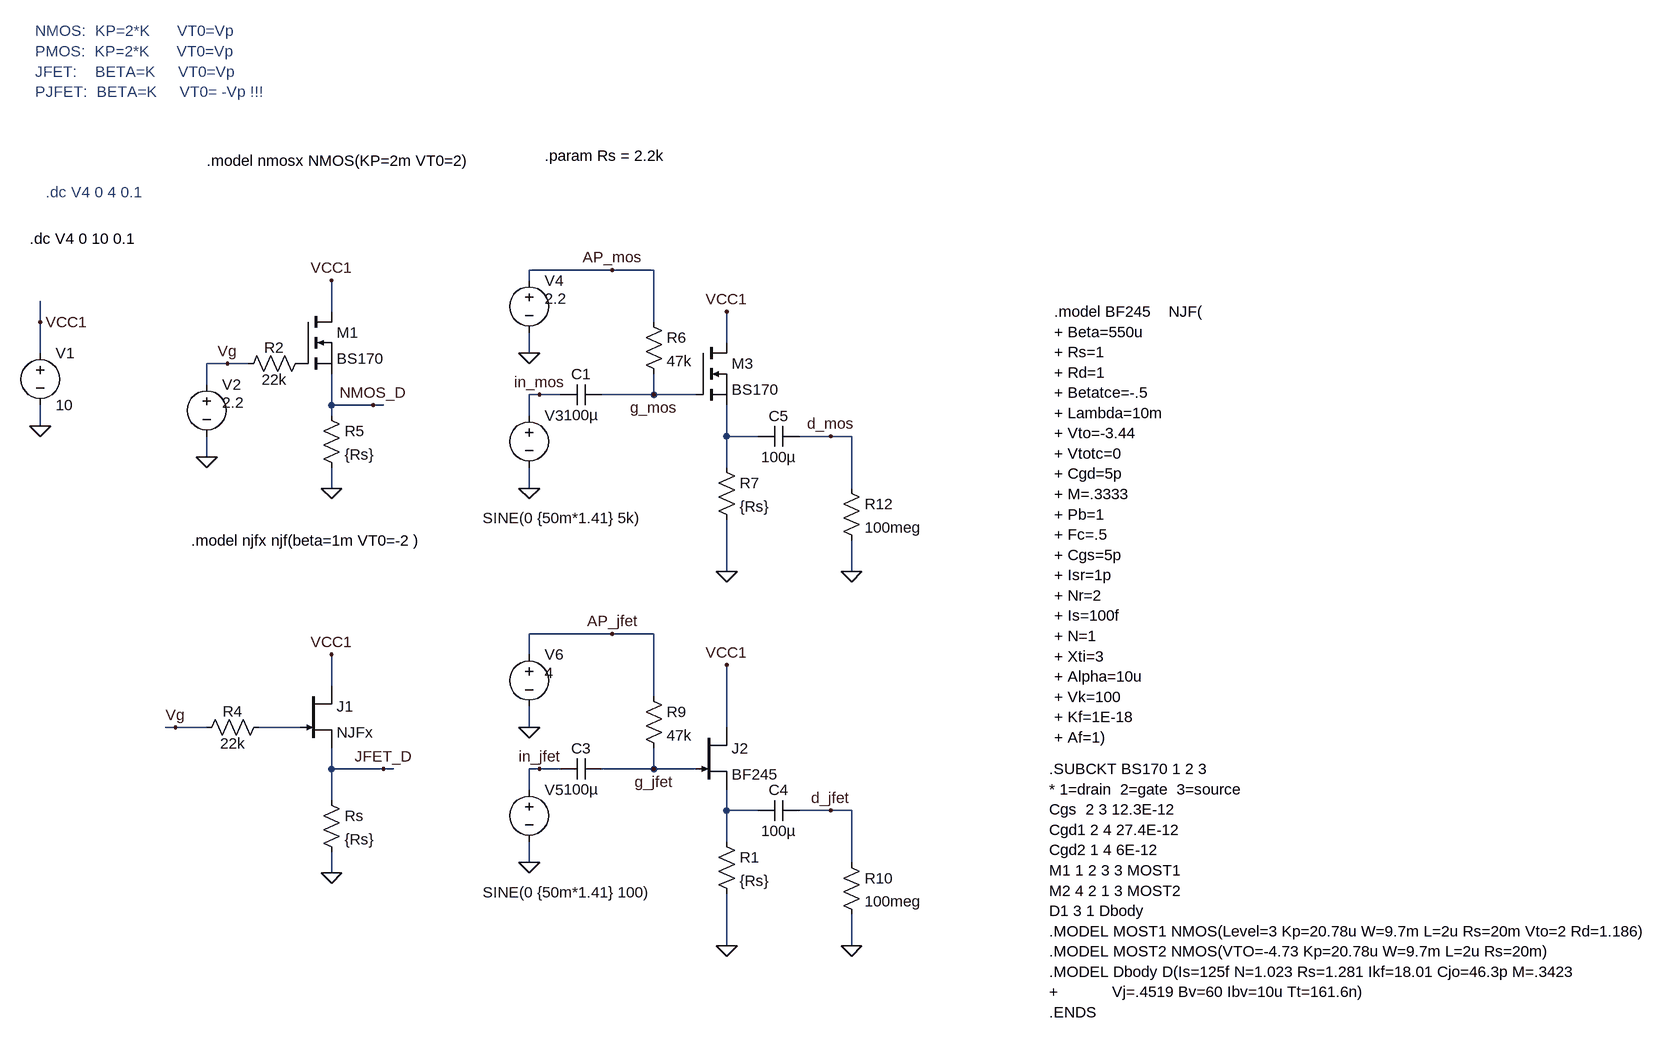
[diagram p0: schematic BS170_BF245_Kennwerte_fet1.asc]
BS170_BF245_Kennwerte_fet1.asc, the LTspice schematic file:
Version 4
SHEET 1 2360 1996
WIRE 624 16 496 16
WIRE 688 16 624 16
WIRE 496 32 496 16
WIRE 192 80 192 32
WIRE -256 96 -256 64
WIRE 688 96 688 16
WIRE 800 128 800 80
WIRE -256 144 -256 96
WIRE 496 144 496 112
WIRE 32 160 0 160
WIRE 64 160 32 160
WIRE 0 192 0 160
WIRE 512 208 496 208
WIRE 544 208 512 208
WIRE 688 208 688 176
WIRE 688 208 608 208
WIRE 752 208 688 208
WIRE 192 224 192 176
WIRE 256 224 192 224
WIRE 272 224 256 224
WIRE 192 240 192 224
WIRE 496 240 496 208
WIRE -256 256 -256 224
WIRE 800 272 800 224
WIRE 848 272 800 272
WIRE 960 272 912 272
WIRE 992 272 960 272
WIRE 0 304 0 272
WIRE 800 320 800 272
WIRE 192 352 192 320
WIRE 496 352 496 320
WIRE 992 352 992 272
WIRE 800 480 800 400
WIRE 992 480 992 432
WIRE 624 576 496 576
WIRE 688 576 624 576
WIRE 496 608 496 576
WIRE 192 656 192 608
WIRE 688 672 688 576
WIRE -48 720 -64 720
WIRE 0 720 -48 720
WIRE 144 720 80 720
WIRE 496 720 496 688
WIRE 800 720 800 624
WIRE 192 784 192 752
WIRE 272 784 192 784
WIRE 288 784 272 784
WIRE 512 784 496 784
WIRE 544 784 512 784
WIRE 688 784 688 752
WIRE 688 784 608 784
WIRE 752 784 688 784
WIRE 496 816 496 784
WIRE 192 832 192 784
WIRE 800 848 800 816
WIRE 848 848 800 848
WIRE 960 848 912 848
WIRE 992 848 960 848
WIRE 800 896 800 848
WIRE 496 928 496 896
WIRE 992 928 992 848
WIRE 192 944 192 912
WIRE 800 1056 800 976
WIRE 992 1056 992 1008
FLAG -256 256 0
FLAG 0 304 0
FLAG -256 96 VCC1
FLAG 192 944 0
FLAG 192 608 VCC1
FLAG 32 160 Vg
FLAG -48 720 Vg
FLAG 272 784 JFET_D
FLAG 496 352 0
FLAG 496 144 0
FLAG 624 16 AP_mos
FLAG 688 208 g_mos
FLAG 512 208 in_mos
FLAG 800 1056 0
FLAG 496 928 0
FLAG 800 624 VCC1
FLAG 496 720 0
FLAG 624 576 AP_jfet
FLAG 688 784 g_jfet
FLAG 960 848 d_jfet
FLAG 512 784 in_jfet
FLAG 992 1056 0
FLAG 800 480 0
FLAG 800 80 VCC1
FLAG 992 480 0
FLAG 960 272 d_mos
FLAG 192 352 0
FLAG 192 32 VCC1
FLAG 256 224 NMOS_D
SYMBOL voltage -256 128 R0
WINDOW 123 0 0 Left 2
WINDOW 39 0 0 Left 2
SYMATTR InstName V1
SYMATTR Value 10
SYMBOL voltage 0 176 R0
WINDOW 123 0 0 Left 2
WINDOW 39 0 0 Left 2
WINDOW 3 24 44 Left 2
SYMATTR Value 2.2
SYMATTR InstName V2
SYMBOL res 48 176 R270
WINDOW 0 25 56 VTop 2
WINDOW 3 7 56 VBottom 2
SYMATTR InstName R2
SYMATTR Value 22k
SYMBOL njf 144 656 R0
SYMATTR InstName J1
SYMATTR Value NJFx
SYMBOL res 176 816 R0
SYMATTR InstName Rs
SYMATTR Value {Rs}
SYMBOL res -16 736 R270
WINDOW 0 25 56 VTop 2
WINDOW 3 7 56 VBottom 2
SYMATTR InstName R4
SYMATTR Value 22k
SYMBOL voltage 496 224 R0
WINDOW 123 0 0 Left 2
WINDOW 39 0 0 Left 2
WINDOW 3 -71 174 Left 2
SYMATTR Value SINE(0 {50m*1.41} 5k)
SYMATTR InstName V3
SYMBOL res 672 80 R0
SYMATTR InstName R6
SYMATTR Value 47k
SYMBOL cap 544 224 R270
WINDOW 0 32 32 VTop 2
WINDOW 3 0 32 VBottom 2
SYMATTR InstName C1
SYMATTR Value 100µ
SYMBOL voltage 496 16 R0
WINDOW 123 0 0 Left 2
WINDOW 39 0 0 Left 2
WINDOW 3 24 44 Left 2
SYMATTR Value 2.2
SYMATTR InstName V4
SYMBOL res 672 656 R0
SYMATTR InstName R9
SYMATTR Value 47k
SYMBOL cap 544 800 R270
WINDOW 0 32 32 VTop 2
WINDOW 3 0 32 VBottom 2
SYMATTR InstName C3
SYMATTR Value 100µ
SYMBOL cap 848 864 R270
WINDOW 0 32 32 VTop 2
WINDOW 3 0 32 VBottom 2
SYMATTR InstName C4
SYMATTR Value 100µ
SYMBOL res 976 912 R0
SYMATTR InstName R10
SYMATTR Value 100meg
SYMBOL voltage 496 800 R0
WINDOW 123 0 0 Left 2
WINDOW 39 0 0 Left 2
WINDOW 3 -71 174 Left 2
SYMATTR Value SINE(0 {50m*1.41} 100)
SYMATTR InstName V5
SYMBOL voltage 496 592 R0
WINDOW 123 0 0 Left 2
WINDOW 39 0 0 Left 2
WINDOW 3 24 44 Left 2
SYMATTR Value 4
SYMATTR InstName V6
SYMBOL njf 752 720 R0
SYMATTR InstName J2
SYMATTR Value BF245
SYMBOL cap 848 288 R270
WINDOW 0 32 32 VTop 2
WINDOW 3 0 32 VBottom 2
SYMATTR InstName C5
SYMATTR Value 100µ
SYMBOL res 976 336 R0
SYMATTR InstName R12
SYMATTR Value 100meg
SYMBOL nmos 752 128 R0
SYMATTR InstName M3
SYMATTR Value BS170
SYMATTR Prefix X
SYMBOL nmos 144 80 R0
SYMATTR InstName M1
SYMATTR Value BS170
SYMATTR Prefix X
SYMBOL res 784 880 R0
SYMATTR InstName R1
SYMATTR Value {Rs}
SYMBOL res 784 304 R0
SYMATTR InstName R7
SYMATTR Value {Rs}
SYMBOL res 176 224 R0
SYMATTR InstName R5
SYMATTR Value {Rs}
TEXT -272 -32 Left 2 !.dc V4 0 10 0.1
TEXT 0 -152 Left 2 !.model nmosx NMOS(KP=2m VT0=2)
TEXT -24 432 Left 2 !.model njfx njf(beta=1m VT0=-2 )
TEXT -264 -352 Left 2 ;NMOS:  KP=2*K      VT0=Vp\nPMOS:  KP=2*K      VT0=Vp\nJFET:    BETA=K     VT0=Vp\nPJFET:  BETA=K     VT0= -Vp !!!
TEXT 520 -160 Left 2 !.param Rs = 2.2k
TEXT 1296 784 Left 2 !.SUBCKT BS170 1 2 3\n* 1=drain  2=gate  3=source\nCgs  2 3 12.3E-12\nCgd1 2 4 27.4E-12\nCgd2 1 4 6E-12\nM1 1 2 3 3 MOST1\nM2 4 2 1 3 MOST2\nD1 3 1 Dbody\n.MODEL MOST1 NMOS(Level=3 Kp=20.78u W=9.7m L=2u Rs=20m Vto=2 Rd=1.186)\n.MODEL MOST2 NMOS(VTO=-4.73 Kp=20.78u W=9.7m L=2u Rs=20m)\n.MODEL Dbody D(Is=125f N=1.023 Rs=1.281 Ikf=18.01 Cjo=46.3p M=.3423\n+            Vj=.4519 Bv=60 Ibv=10u Tt=161.6n)\n.ENDS
TEXT 1304 80 Left 2 !.model BF245    NJF(\n+ Beta=550u \n+ Rs=1 \n+ Rd=1 \n+ Betatce=-.5 \n+ Lambda=10m \n+ Vto=-3.44\n+ Vtotc=0 \n+ Cgd=5p \n+ M=.3333 \n+ Pb=1 \n+ Fc=.5 \n+ Cgs=5p \n+ Isr=1p \n+ Nr=2 \n+ Is=100f\n+ N=1 \n+ Xti=3 \n+ Alpha=10u \n+ Vk=100 \n+ Kf=1E-18 \n+ Af=1)
TEXT -248 -104 Left 2 ;.dc V4 0 4 0.1

The netlist it stands for:
* BS170_BF245_Kennwerte_fet1.asc
V1 VCC1 0 10
V2 Vg 0 2.2
R2 Vg P001 22k
J1 VCC1 N002 JFET_D NJFx
Rs JFET_D 0 {Rs}
R4 Vg N002 22k
V3 in_mos 0 SINE(0 {50m*1.41} 5k)
R6 AP_mos g_mos 47k
C1 in_mos g_mos 100µ
V4 AP_mos 0 2.2
R9 AP_jfet g_jfet 47k
C3 in_jfet g_jfet 100µ
C4 N003 d_jfet 100µ
R10 d_jfet 0 100meg
V5 in_jfet 0 SINE(0 {50m*1.41} 100)
V6 AP_jfet 0 4
J2 VCC1 g_jfet N003 BF245
C5 N001 d_mos 100µ
R12 d_mos 0 100meg
XM3 VCC1 g_mos N001 BS170  ; pins D G S
XM1 VCC1 P001 NMOS_D BS170  ; pins D G S
R1 N003 0 {Rs}
R7 N001 0 {Rs}
R5 NMOS_D 0 {Rs}
.model NJF NJF
.model PJF PJF
.lib standard.jft
.dc V4 0 10 0.1
.model nmosx NMOS(KP=2m VT0=2)
.model njfx njf(beta=1m VT0=-2 )
* NMOS:  KP=2*K      VT0=Vp
* PMOS:  KP=2*K      VT0=Vp
* JFET:    BETA=K     VT0=Vp
* PJFET:  BETA=K     VT0= -Vp !!!
.param Rs = 2.2k
.SUBCKT BS170 1 2 3
* 1=drain  2=gate  3=source
Cgs  2 3 12.3E-12
Cgd1 2 4 27.4E-12
Cgd2 1 4 6E-12
M1 1 2 3 3 MOST1
M2 4 2 1 3 MOST2
D1 3 1 Dbody
.MODEL MOST1 NMOS(Level=3 Kp=20.78u W=9.7m L=2u Rs=20m Vto=2 Rd=1.186)
.MODEL MOST2 NMOS(VTO=-4.73 Kp=20.78u W=9.7m L=2u Rs=20m)
.MODEL Dbody D(Is=125f N=1.023 Rs=1.281 Ikf=18.01 Cjo=46.3p M=.3423
+            Vj=.4519 Bv=60 Ibv=10u Tt=161.6n)
.ENDS
.model BF245    NJF(
+ Beta=550u
+ Rs=1
+ Rd=1
+ Betatce=-.5
+ Lambda=10m
+ Vto=-3.44
+ Vtotc=0
+ Cgd=5p
+ M=.3333
+ Pb=1
+ Fc=.5
+ Cgs=5p
+ Isr=1p
+ Nr=2
+ Is=100f
+ N=1
+ Xti=3
+ Alpha=10u
+ Vk=100
+ Kf=1E-18
+ Af=1)
* .dc V4 0 4 0.1
.backanno
.end